# Altium schematic sheet QCopterFC_EXT_Sch.SchDoc
size A4
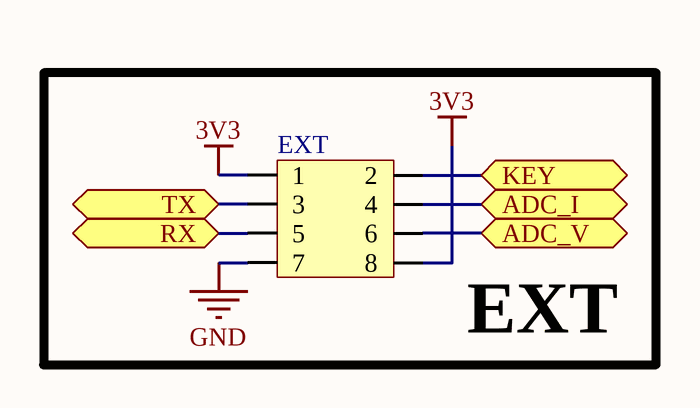
[diagram p0: QCopterFC_EXT_Sch.SchDoc]

## Parts
EXT  HDR2X4_90_2.54  [HDR2X4_90_2.54]  (value not drawn)

## Ports
ADC_I, ADC_V, KEY, RX, TX

## Nets
3V3: EXT.1 EXT.8
GND: EXT.7
ADC_I: EXT.4 ; port ADC_I
ADC_V: EXT.6 ; port ADC_V
KEY: EXT.2 ; port KEY
RX: EXT.5 ; port RX
TX: EXT.3 ; port TX

## Notes on the sheet
- Labels drawn without touching a wire or pin: EXT

## Library data of the parts
EXT = HDR2X4_90_2.54: Header